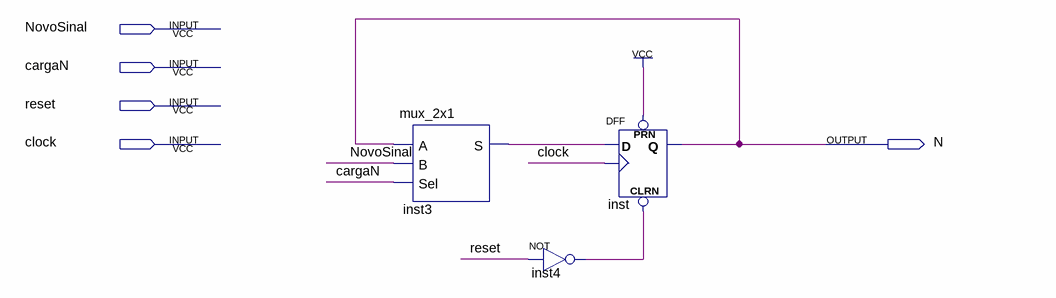
[diagram p0: schematic sheet]
// Quartus schematic registrador_N.bdf as structural Verilog: 3 symbols, 5 pins
module registrador_N (
  input  NovoSinal,
  input  cargaN,
  input  reset,
  input  clock,
  output N
);

  wire inst3_s, inst4_out;

  mux_2x1 inst3 (.A(N), .B(NovoSinal), .Sel(cargaN), .S(inst3_s));
  not inst4 (inst4_out, reset);
  DFF inst (.CLRN(inst4_out), .CLK(clock), .D(inst3_s), .PRN(1'b1), .Q(N));
endmodule
